# EAGLE design PLT-01-RevB (EAGLE 7.6.0)
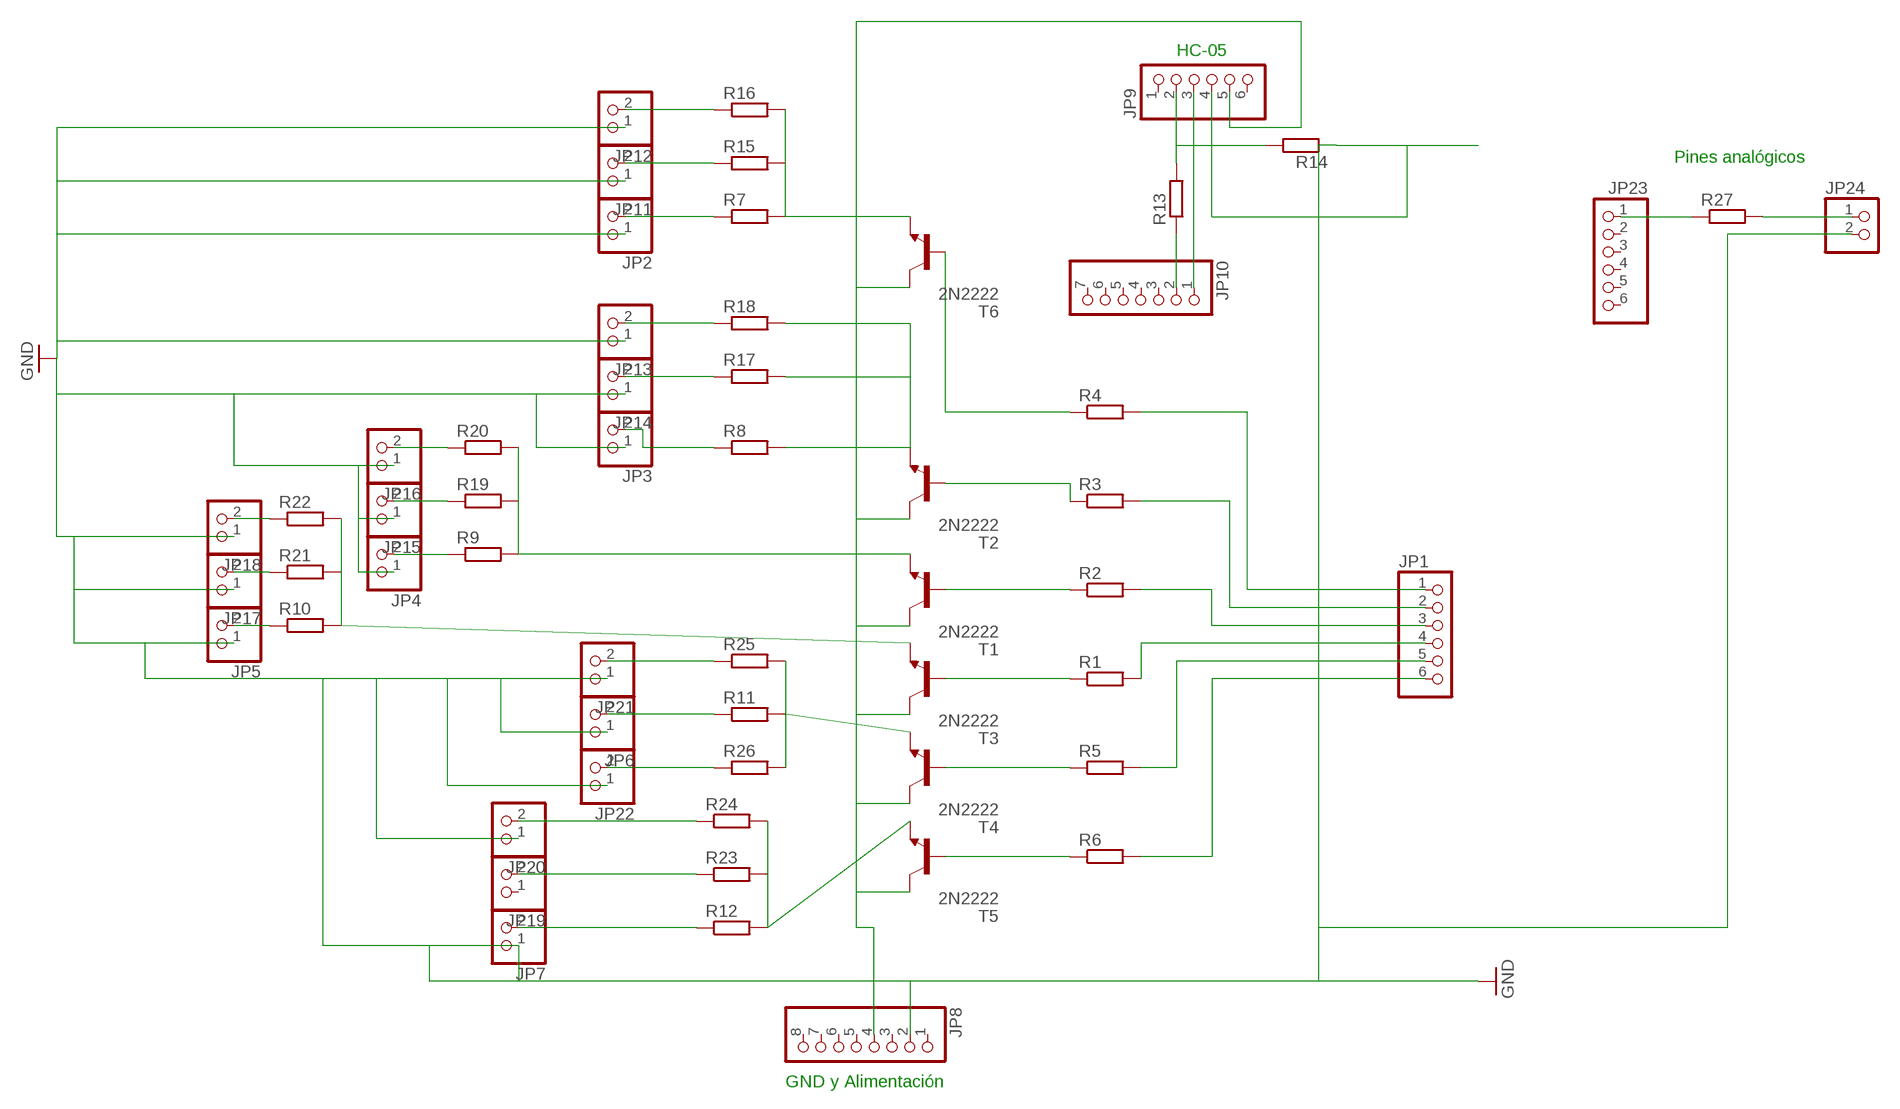
[diagram p0: schematic, sheet 1]

## Parts
JP1  PINHD-1X6  [1X06]
JP2  PINHD-1X2  [1X02]
JP3  PINHD-1X2  [1X02]
JP4  PINHD-1X2  [1X02]
JP5  PINHD-1X2  [1X02]
JP6  PINHD-1X2  [1X02]
JP7  PINHD-1X2  [1X02]
JP8  PINHD-1X8  [1X08]
JP9  PINHD-1X6  [1X06]
JP10  PINHD-1X7  [1X07]
JP11  PINHD-1X2  [1X02]
JP12  PINHD-1X2  [1X02]
JP13  PINHD-1X2  [1X02]
JP14  PINHD-1X2  [1X02]
JP15  PINHD-1X2  [1X02]
JP16  PINHD-1X2  [1X02]
JP17  PINHD-1X2  [1X02]
JP18  PINHD-1X2  [1X02]
JP19  PINHD-1X2  [1X02]
JP20  PINHD-1X2  [1X02]
JP21  PINHD-1X2  [1X02]
JP22  PINHD-1X2  [1X02]
JP23  PINHD-1X6  [1X06]
JP24  PINHD-1X2  [1X02]
R1  R-EU_0207/10  [0207/10]
R2  R-EU_0207/10  [0207/10]
R3  R-EU_0207/10  [0207/10]
R4  R-EU_0207/10  [0207/10]
R5  R-EU_0207/10  [0207/10]
R6  R-EU_0207/10  [0207/10]
R7  R-EU_0207/10  [0207/10]
R8  R-EU_0207/10  [0207/10]
R9  R-EU_0207/10  [0207/10]
R10  R-EU_0207/10  [0207/10]
R11  R-EU_0207/10  [0207/10]
R12  R-EU_0207/10  [0207/10]
R13  R-EU_0207/10  [0207/10]
R14  R-EU_0207/10  [0207/10]
R15  R-EU_0207/10  [0207/10]
R16  R-EU_0207/10  [0207/10]
R17  R-EU_0207/10  [0207/10]
R18  R-EU_0207/10  [0207/10]
R19  R-EU_0207/10  [0207/10]
R20  R-EU_0207/10  [0207/10]
R21  R-EU_0207/10  [0207/10]
R22  R-EU_0207/10  [0207/10]
R23  R-EU_0207/10  [0207/10]
R24  R-EU_0207/10  [0207/10]
R25  R-EU_0207/10  [0207/10]
R26  R-EU_0207/10  [0207/10]
R27  R-EU_0207/10  [0207/10]
T1  2N2222  [TO92-EBC-OVAL]
T2  2N2222  [TO92-EBC-OVAL]
T3  2N2222  [TO92-EBC-OVAL]
T4  2N2222  [TO92-EBC-OVAL]
T5  2N2222  [TO92-EBC-OVAL]
T6  2N2222  [TO92-EBC-OVAL]

## Nets
5V: JP8.4 JP9.5 T1.C T2.C T3.C T4.C T5.C T6.C
GND: JP2.1 JP3.1 JP4.1 JP5.1 JP6.1 JP7.1 JP8.2 JP9.4 JP11.1 JP12.1 JP13.1 JP14.1 JP15.1 JP16.1 JP17.1 JP18.1 JP20.1 JP21.1 JP22.1 JP24.2 R14.1
N$1: JP1.1 R4.2
N$2: JP1.2 R3.2
N$3: JP1.3 R2.2
N$4: JP1.4 R1.2
N$5: JP1.5 R5.2
N$6: JP1.6 R6.2
N$7: R6.1 T5.B
N$8: R5.1 T4.B
N$9: R1.1 T3.B
N$10: R2.1 T1.B
N$11: R3.1 T2.B
N$12: R4.1 T6.B
N$13: R7.2 R15.2 R16.2 T6.E
N$14: JP2.2 R7.1
N$15: R8.2 R17.2 R18.2 T2.E
N$16: JP3.2 R8.1
N$17: R9.2 R19.2 R20.2 T1.E
N$18: JP4.2 R9.1
N$19: R10.2 R21.2 R22.2 T3.E
N$20: JP5.2 R10.1
N$21: R11.2 R25.2 R26.2 T4.E
N$22: JP6.2 R11.1
N$23: R12.2 R23.2 R24.2 T5.E
N$24: JP7.2 R12.1
N$25: JP10.2 R13.1
N$26: JP9.2 R13.2 R14.2
N$27: JP9.3 JP10.1
N$29: JP13.2 R18.1
N$30: JP14.2 R17.1
N$31: JP17.2 R21.1
N$32: JP18.2 R22.1
N$33: JP19.2 R23.1
N$34: JP20.2 R24.1
N$35: JP21.2 R25.1
N$36: JP22.2 R26.1
N$37: JP12.2 R16.1
N$38: JP11.2 R15.1
N$39: JP16.2 R20.1
N$40: JP15.2 R19.1
N$41: JP23.1 R27.1
N$42: JP24.1 R27.2
Unconnected: JP8.1 JP8.3 JP8.5 JP8.6 JP8.7 JP8.8 JP9.1 JP9.6 JP10.3 JP10.4 JP10.5 JP10.6 JP10.7 JP19.1 JP23.2 JP23.3 JP23.4 JP23.5 JP23.6

## Notes on the sheet
- HC-05
- Pines analógicos
- GND y Alimentación

## Library data of the parts
JP1 JP9 JP23 = pinhead:PINHD-1X6: PIN HEADER
JP2-JP7 JP11-JP22 JP24 = pinhead:PINHD-1X2: PIN HEADER
JP8 = pinhead:PINHD-1X8: PIN HEADER
JP10 = pinhead:PINHD-1X7: PIN HEADER
R1-R27 = resistor:R-EU_: RESISTOR, European symbol
T1-T6 = adafruit:2N2222: NPN TRANSISTOR Big oval pads

## Board
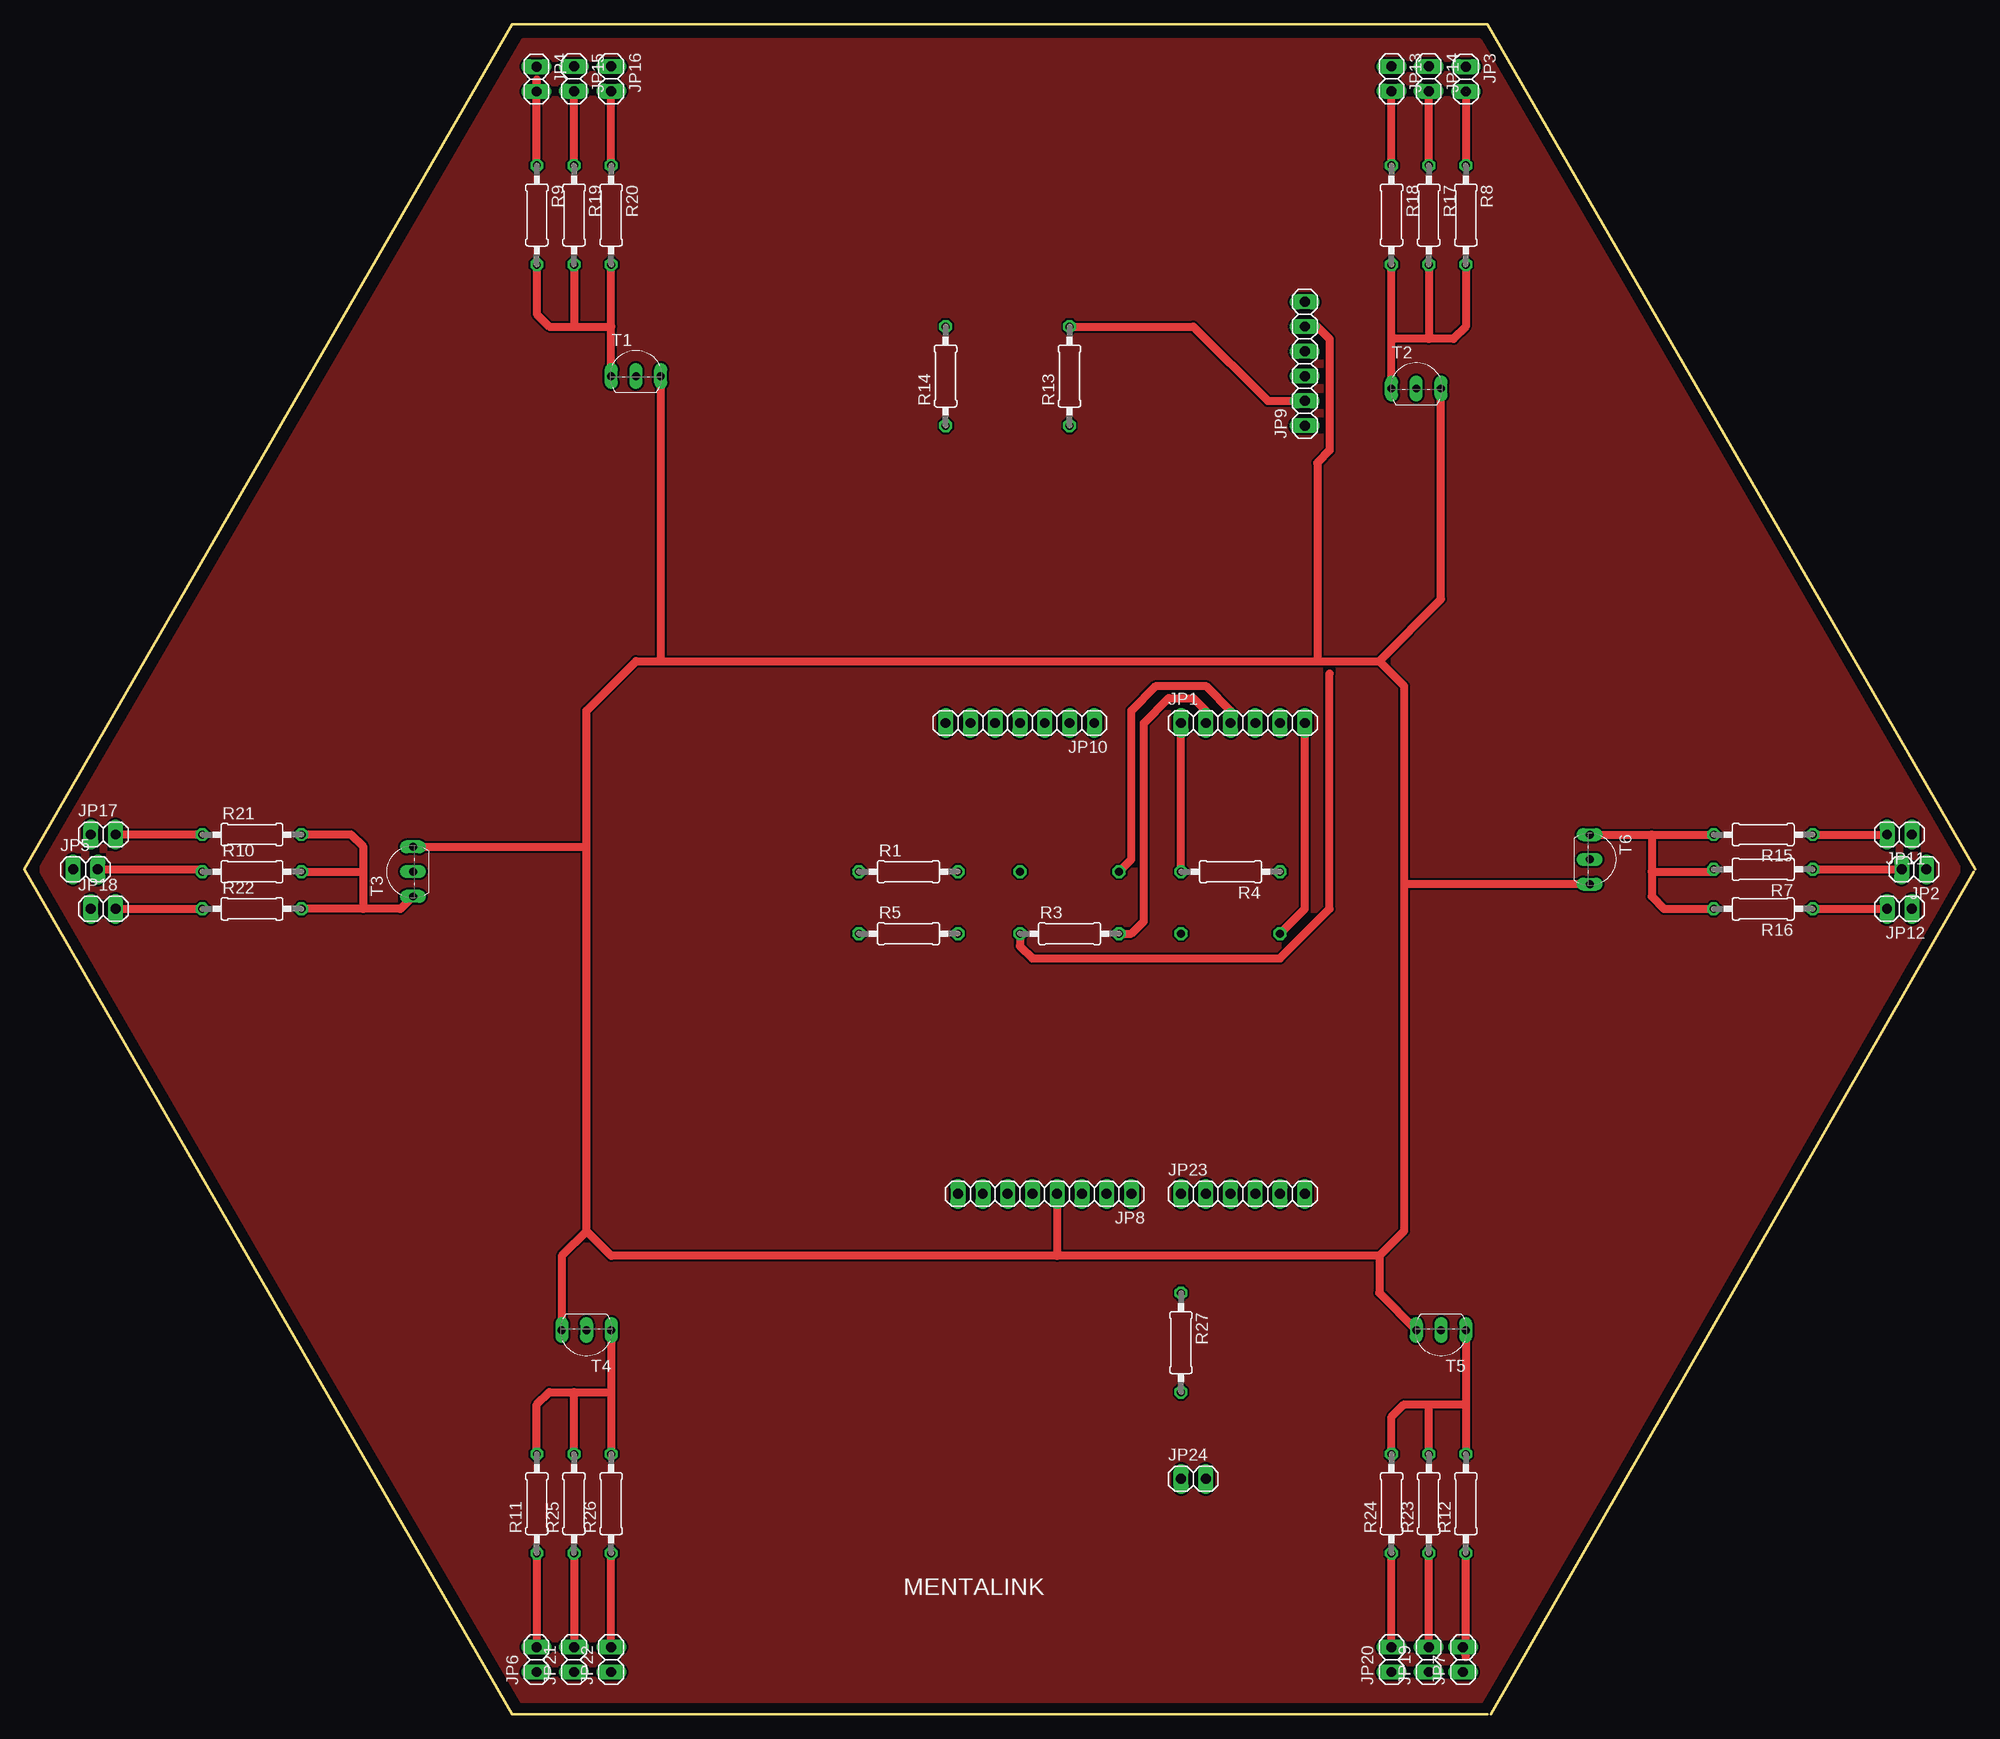
[diagram p1: board, top side]
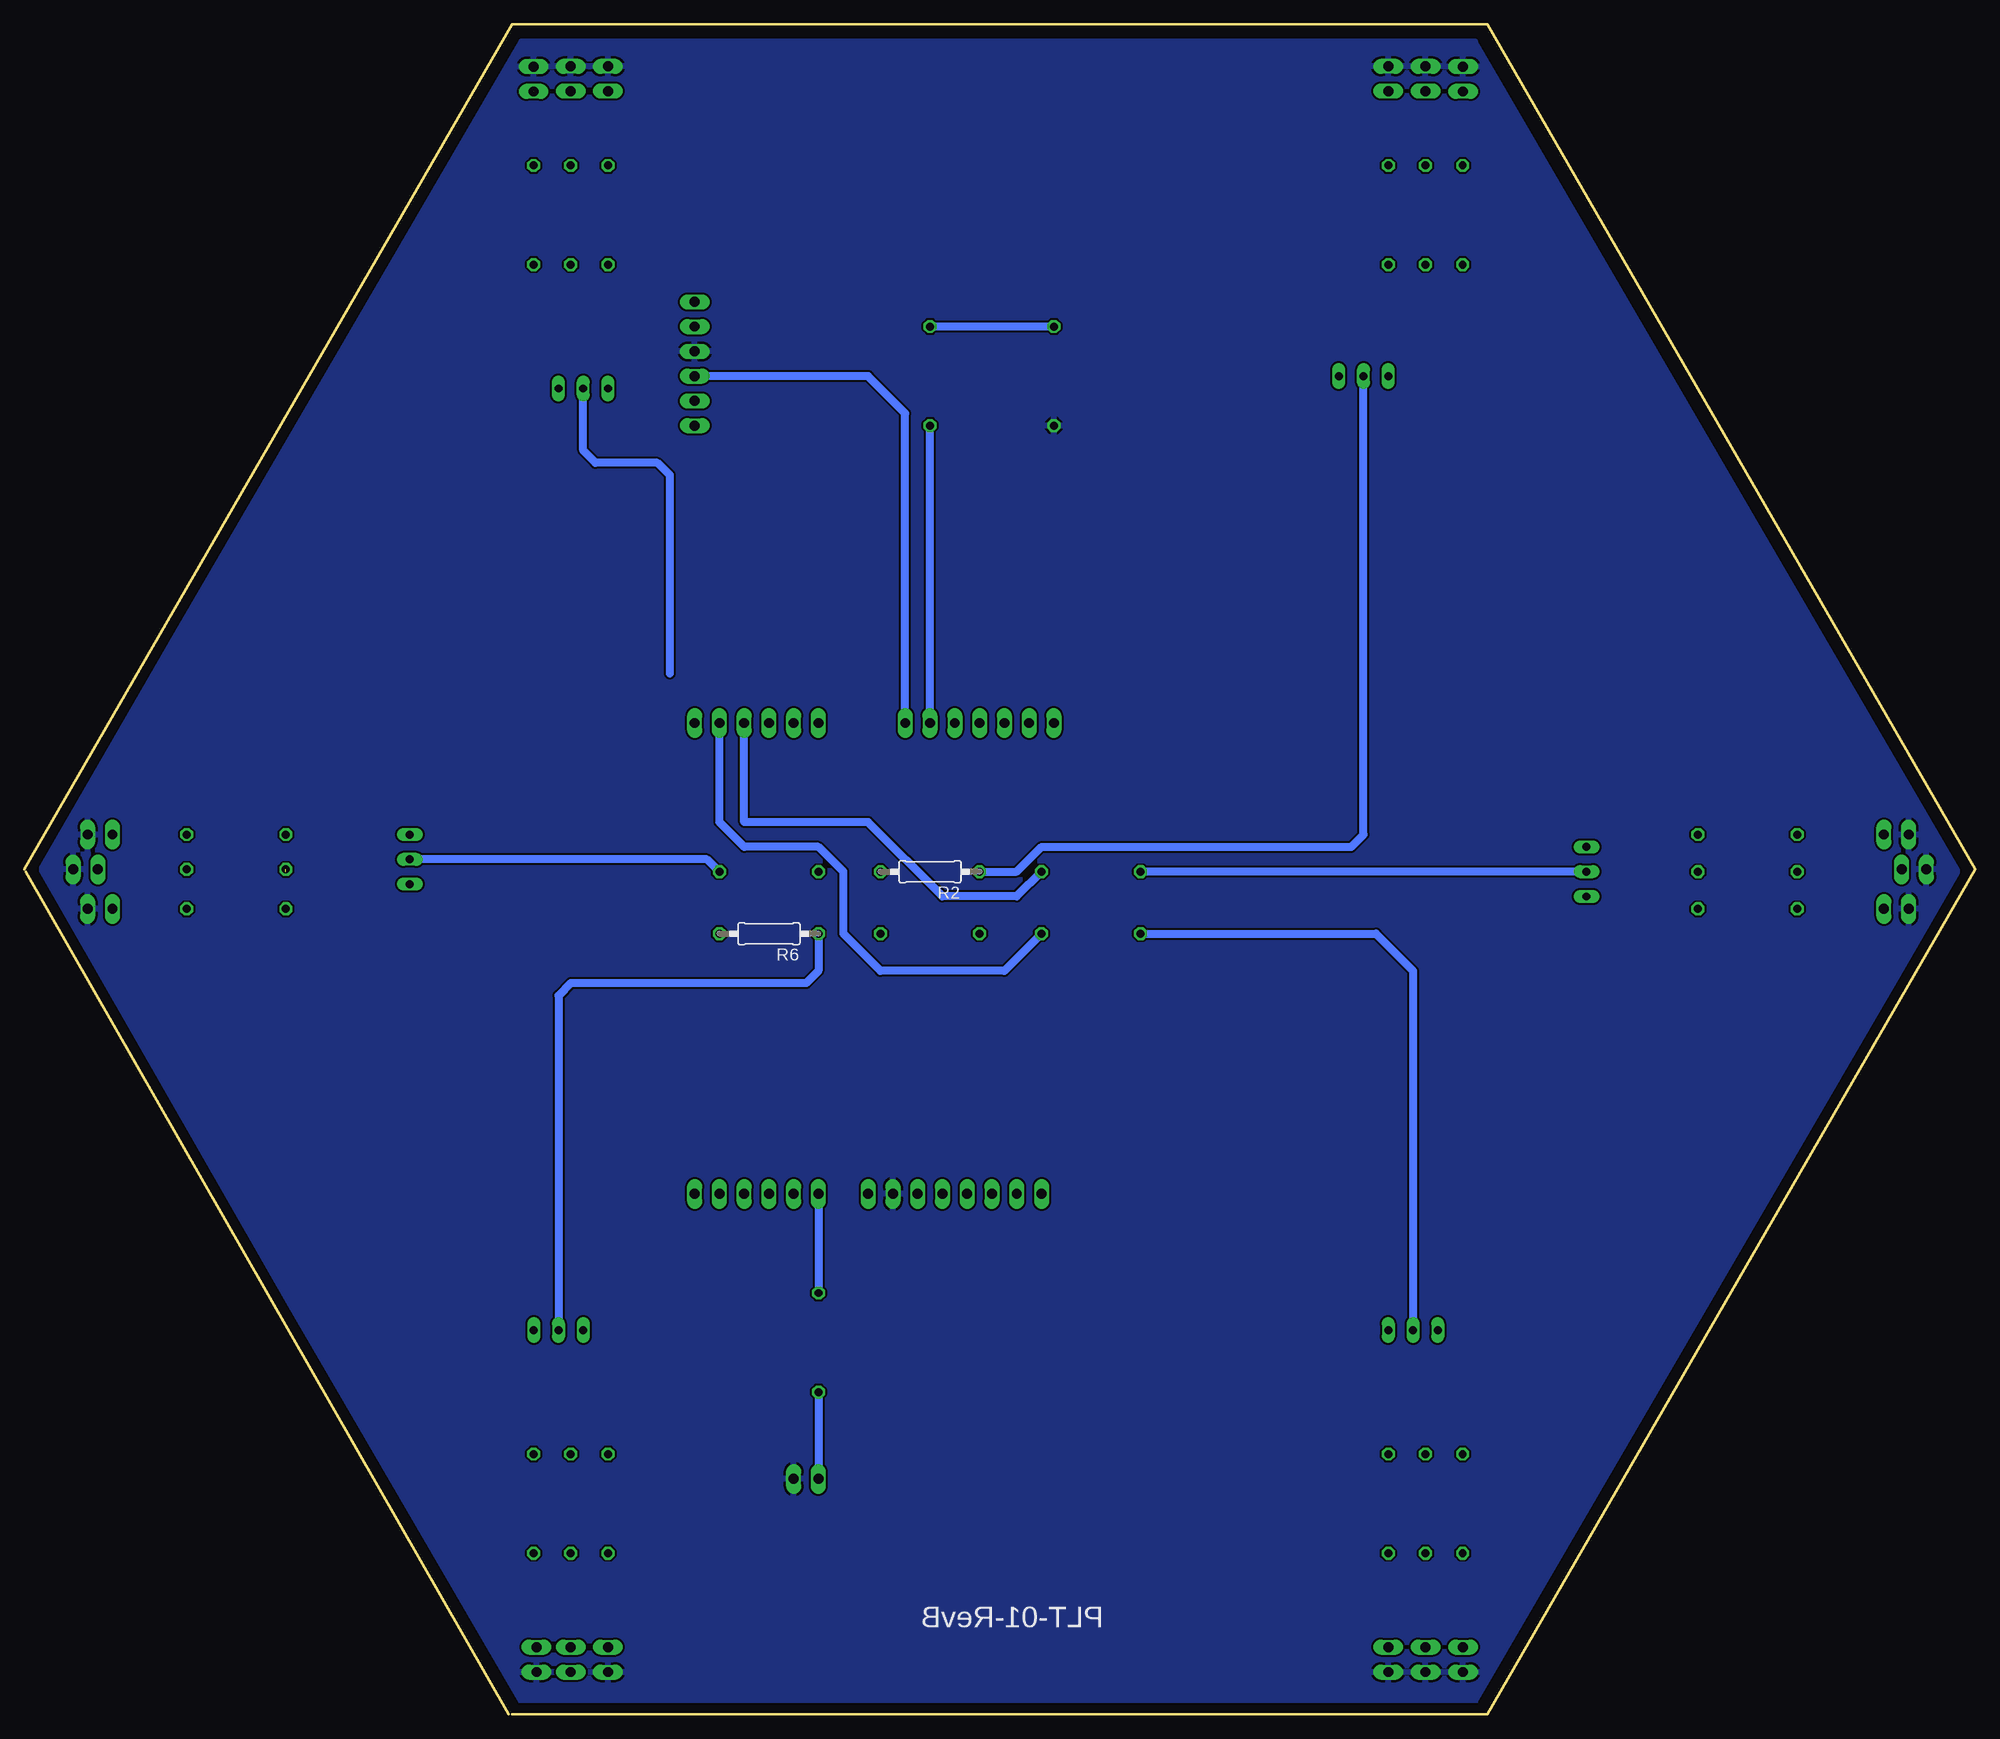
[diagram p2: board, bottom side, seen from below]

Size 200 x 173.21 mm. Coordinates in mm from the lower left corner, seen from the top.
Outline: 150,0 50,0 0,86.6 50,173.21 150,173.21 200,86.6
Outline: 199.86,86.36 150.33,0
Copper layers (1*16): Top 0.035mm / dielectric 1.5mm / Bottom 0.035mm
Design rules "default": minimum track width 10mil, minimum drill 24mil, track to track 8mil, track to pad 8mil, pad to pad 8mil, via to via 8mil, smd to smd 8mil, copper to edge 40mil, drill to drill 8mil, minimum pad ring 10mil, minimum via ring 8mil, stop-mask expansion 4mil, vias tented up to drill 0mil, thermal gap 10mil

### Footprints (pad centres in the part's own frame; a part is rotated, then mirrored left to right if it is on the bottom)
1X06 = drill 1.016 long: 1 -6.35,0; 2 -3.81,0; 3 -1.27,0; 4 1.27,0; 5 3.81,0; 6 6.35,0
1X02 = drill 1.016 long: 1 -1.27,0; 2 1.27,0
1X08 = drill 1.016 long: 1 -8.89,0; 2 -6.35,0; 3 -3.81,0; 4 -1.27,0; 5 1.27,0; 6 3.81,0; 7 6.35,0; 8 8.89,0
1X07 = drill 1.016 long: 1 -7.62,0; 2 -5.08,0; 3 -2.54,0; 4 0,0; 5 2.54,0; 6 5.08,0; 7 7.62,0
0207/10 = drill 0.813 octagon: 1 -5.08,0; 2 5.08,0
TO92-EBC-OVAL = drill 0.813 long: B 0,-1.27; C 2.54,-1.27; E -2.54,-1.27

### Placement (x,y rotation side)
JP1  124.93,101.6 0 top
JP2  193.73,86.6 180 top
JP3  147.79,167.6 270 top
JP4  52.5,167.6 270 top
JP5  6.27,86.6 0 top
JP6  52.5,5.6 90 top
JP7  147.5,5.6 90 top
JP8  104.61,53.34 180 top
JP9  131.28,138.43 90 top
JP10  102.07,101.6 180 top
JP11  192.24,90.17 180 top
JP12  192.24,82.55 180 top
JP13  140.17,167.64 270 top
JP14  143.98,167.64 270 top
JP15  56.35,167.64 270 top
JP16  60.16,167.64 270 top
JP17  8.09,90.17 0 top
JP18  8.09,82.55 0 top
JP19  143.98,5.6 90 top
JP20  140.17,5.6 90 top
JP21  56.35,5.6 90 top
JP22  60.16,5.6 90 top
JP23  124.93,53.34 0 top
JP24  119.85,24.13 0 top
R1  90.64,86.36 0 top
R2  107.15,86.36 180 bottom
R3  107.15,80.01 0 top
R4  123.66,86.36 180 top
R5  90.64,80.01 0 top
R6  123.66,80.01 180 bottom
R7  178.27,86.6 180 top
R8  147.79,153.67 270 top
R9  52.54,153.67 270 top
R10  23.33,86.36 0 top
R11  52.54,21.59 90 top
R12  147.79,21.59 90 top
R13  107.15,137.16 90 top
R14  94.45,137.16 90 top
R15  178.27,90.17 180 top
R16  178.27,82.55 180 top
R17  143.98,153.67 270 top
R18  140.17,153.67 270 top
R19  56.35,153.67 270 top
R20  60.16,153.67 270 top
R21  23.33,90.17 0 top
R22  23.33,82.55 0 top
R23  143.98,21.59 90 top
R24  140.17,21.59 90 top
R25  56.35,21.59 90 top
R26  60.16,21.59 90 top
R27  118.58,38.1 270 top
T1  62.7,138.43 0 top
T2  142.71,137.16 0 top
T3  38.57,86.36 90 top
T4  57.62,38.1 180 top
T5  145.25,38.1 180 top
T6  161.76,87.63 270 top

### Tracks (layer width: path | path; a pad name or v marks a point on that pad's centre or on a via)
5V
  Top 0.813: 65.24,107.95 62.7,107.95 57.62,102.87 57.62,88.9 | 65.24,107.95 132.55,107.95 | 132.55,107.95 138.9,107.95 | 138.9,107.95 141.44,105.41 141.44,85.09 | 141.44,85.09 141.44,49.53 138.9,46.99 | 138.9,46.99 105.88,46.99 | 105.88,46.99 60.16,46.99 57.62,49.53 | 57.62,49.53 57.62,88.9 | JP8.4 105.88,46.99 | 138.9,107.95 145.25,114.3 T2.C | T3.C 57.62,88.9 | 138.9,46.99 138.9,43.18 T5.C | T6.C 141.44,85.09 | T1.C 65.24,107.95 | 57.62,49.53 55.08,46.99 T4.C | JP9.5 132.55,142.24 133.82,140.97 133.82,129.54 132.55,128.27 132.55,107.95
GND
  pour Bottom: 1.74,86.36 51.27,171.45 149.06,171.45 198.59,86.36 149.06,1.27 51.27,1.27
N$1
  Top 0.813: R4.2 JP1.1
N$2
  Top 0.813: R3.2 113.5,80.01 114.77,81.28 114.77,101.6 117.31,104.14 119.85,104.14 121.12,102.87 JP1.2
N$3
  Top 0.813: R2.2 113.5,87.63 113.5,102.87 116.04,105.41 121.12,105.41 123.66,102.87 JP1.3
N$4
  Bottom 0.813: R1.2 98.26,83.82 105.88,83.82 113.5,91.44 126.2,91.44 JP1.4
N$5
  Bottom 0.813: R5.2 99.53,76.2 112.23,76.2 116.04,80.01 116.04,86.36 118.58,88.9 126.2,88.9 128.74,91.44 JP1.5
N$6
  Top 0.813: R6.2 131.28,82.55 JP1.6
N$7
  Bottom 0.813: R6.1 118.58,76.2 119.85,74.93 143.98,74.93 145.25,73.66 T5.B
N$8
  Bottom 0.813: R5.1 61.43,80.01 57.62,76.2 T4.B
N$9
  Bottom 0.813: T3.B R1.1
N$10
  Bottom 0.813: R2.1 98.26,86.36 95.72,88.9 63.97,88.9 62.7,90.17 T1.B
N$11  (1 unrouted)
  Top 0.813: R3.1 102.07,78.74 103.34,77.47 128.74,77.47 133.82,82.55 133.82,106.68
  Bottom 0.813: 133.82,106.68 133.82,127 135.09,128.27 141.44,128.27 142.71,129.54 T2.B
N$12
  Bottom 0.813: R4.1 130.01,87.63 T6.B
N$13  (1 unrouted)
  Top 0.813: T6.E 166.84,90.17 | 166.84,90.17 R15.2 | 166.84,90.17 166.84,86.36 | 166.84,86.36 166.84,83.82 168.11,82.55 R16.2 | 166.84,86.36 173.19,86.36
N$14
  Top 0.813: R7.1 JP2.2
N$15
  Top 0.813: T2.E 140.17,140.97 | 140.17,140.97 R18.2 | R8.2 147.79,142.24 146.52,140.97 143.98,140.97 | 143.98,140.97 140.17,140.97 | R17.2 143.98,140.97
N$16  (1 unrouted)
  Top 0.813: 147.79,166.37 R8.1
N$17
  Top 0.813: T1.E 60.16,142.24 | 60.16,142.24 R20.2 | R9.2 52.54,143.51 53.81,142.24 56.35,142.24 | 56.35,142.24 60.16,142.24 | R19.2 56.35,142.24
N$18
  Top 0.813: R9.1 52.54,167.56 JP4.2
N$19
  Top 0.813: T3.E 38.57,82.55 34.76,82.55 | 34.76,82.55 R22.2 | 34.76,82.55 34.76,86.36 | 34.76,86.36 34.76,88.9 33.49,90.17 R21.2 | R10.2 34.76,86.36
N$20
  Top 0.813: JP5.2 18.01,86.6 R10.1
N$21
  Top 0.813: T4.E 60.16,33.02 | 60.16,33.02 R26.2 | R11.2 52.54,31.75 53.81,33.02 56.35,33.02 | 56.35,33.02 60.16,33.02 | R25.2 56.35,33.02
N$22
  Top 0.813: R11.1 52.54,6.91 JP6.2
N$23
  Top 0.813: T5.E 147.79,31.75 | 147.79,31.75 R12.2 | R24.2 140.17,30.48 141.44,31.75 143.98,31.75 | 143.98,31.75 147.79,31.75 | R23.2 143.98,31.75
N$24
  Top 0.813: JP7.2 147.79,5.89 R12.1
N$25
  Bottom 0.813: JP10.2 R13.1
N$26
  Top 0.813: R13.2 119.85,142.24 127.47,134.62 JP9.2
  Bottom 0.813: R14.2 R13.2
N$27
  Bottom 0.813: JP10.1 109.69,133.35 113.5,137.16 JP9.3
N$28
  pour Top: 51.27,171.45 149.06,171.45 198.59,86.36 149.06,1.27 51.27,1.27 1.74,86.36
N$29
  Top 0.813: R18.1 JP13.2
N$30
  Top 0.813: R17.1 JP14.2
N$31
  Top 0.813: R21.1 JP17.2
N$32
  Top 0.813: JP18.2 R22.1
N$33
  Top 0.813: JP19.2 R23.1
N$34
  Top 0.813: JP20.2 R24.1
N$35
  Top 0.813: R25.1 JP21.2
N$36
  Top 0.813: JP22.2 R26.1
N$37
  Top 0.813: R16.1 JP12.2
N$38
  Top 0.813: R15.1 JP11.2
N$39
  Top 0.813: R20.1 JP16.2
N$40
  Top 0.813: R19.1 JP15.2
N$41
  Bottom 0.813: JP23.1 R27.1
N$42
  Bottom 0.813: R27.2 JP24.1

### Text on the board
tNames: MENTALINK
bNames: PLT-01-RevB